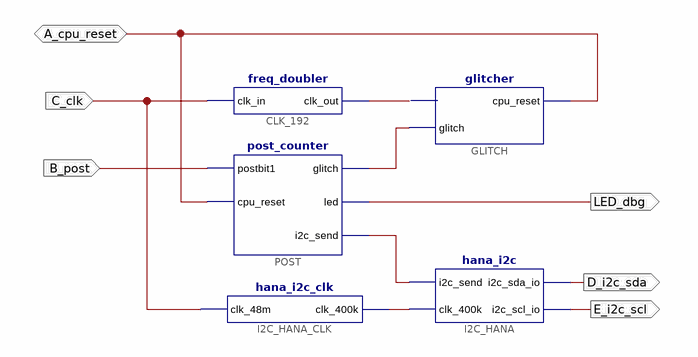
[diagram p0: schematic sheet 1]
// Xilinx ISE schematic main.sch (xbr) as structural Verilog: 5 symbols, 6 ports
module main (
  input  C_clk,
  input  B_post,
  inout  A_cpu_reset,
  output LED_dbg,
  output E_i2c_scl,
  output D_i2c_sda
);

  wire XLXN_12, XLXN_79, XLXN_96, XLXN_98;

  post_counter POST (.cpu_reset(A_cpu_reset), .postbit1(B_post), .glitch(XLXN_79), .i2c_send(XLXN_96), .led(LED_dbg));
  freq_doubler CLK_192 (.clk_in(C_clk), .clk_out(XLXN_12));
  hana_i2c_clk I2C_HANA_CLK (.clk_48m(C_clk), .clk_400k(XLXN_98));
  glitcher GLITCH (.clk_96m(XLXN_12), .cpu_reset(A_cpu_reset), .glitch(XLXN_79));
  hana_i2c I2C_HANA (.clk_400k(XLXN_98), .i2c_send(XLXN_96), .i2c_sda_io(D_i2c_sda), .i2c_scl_io(E_i2c_scl));
endmodule
